# EAGLE design schema_rs232_MAX3232 (EAGLE 9.0.1)
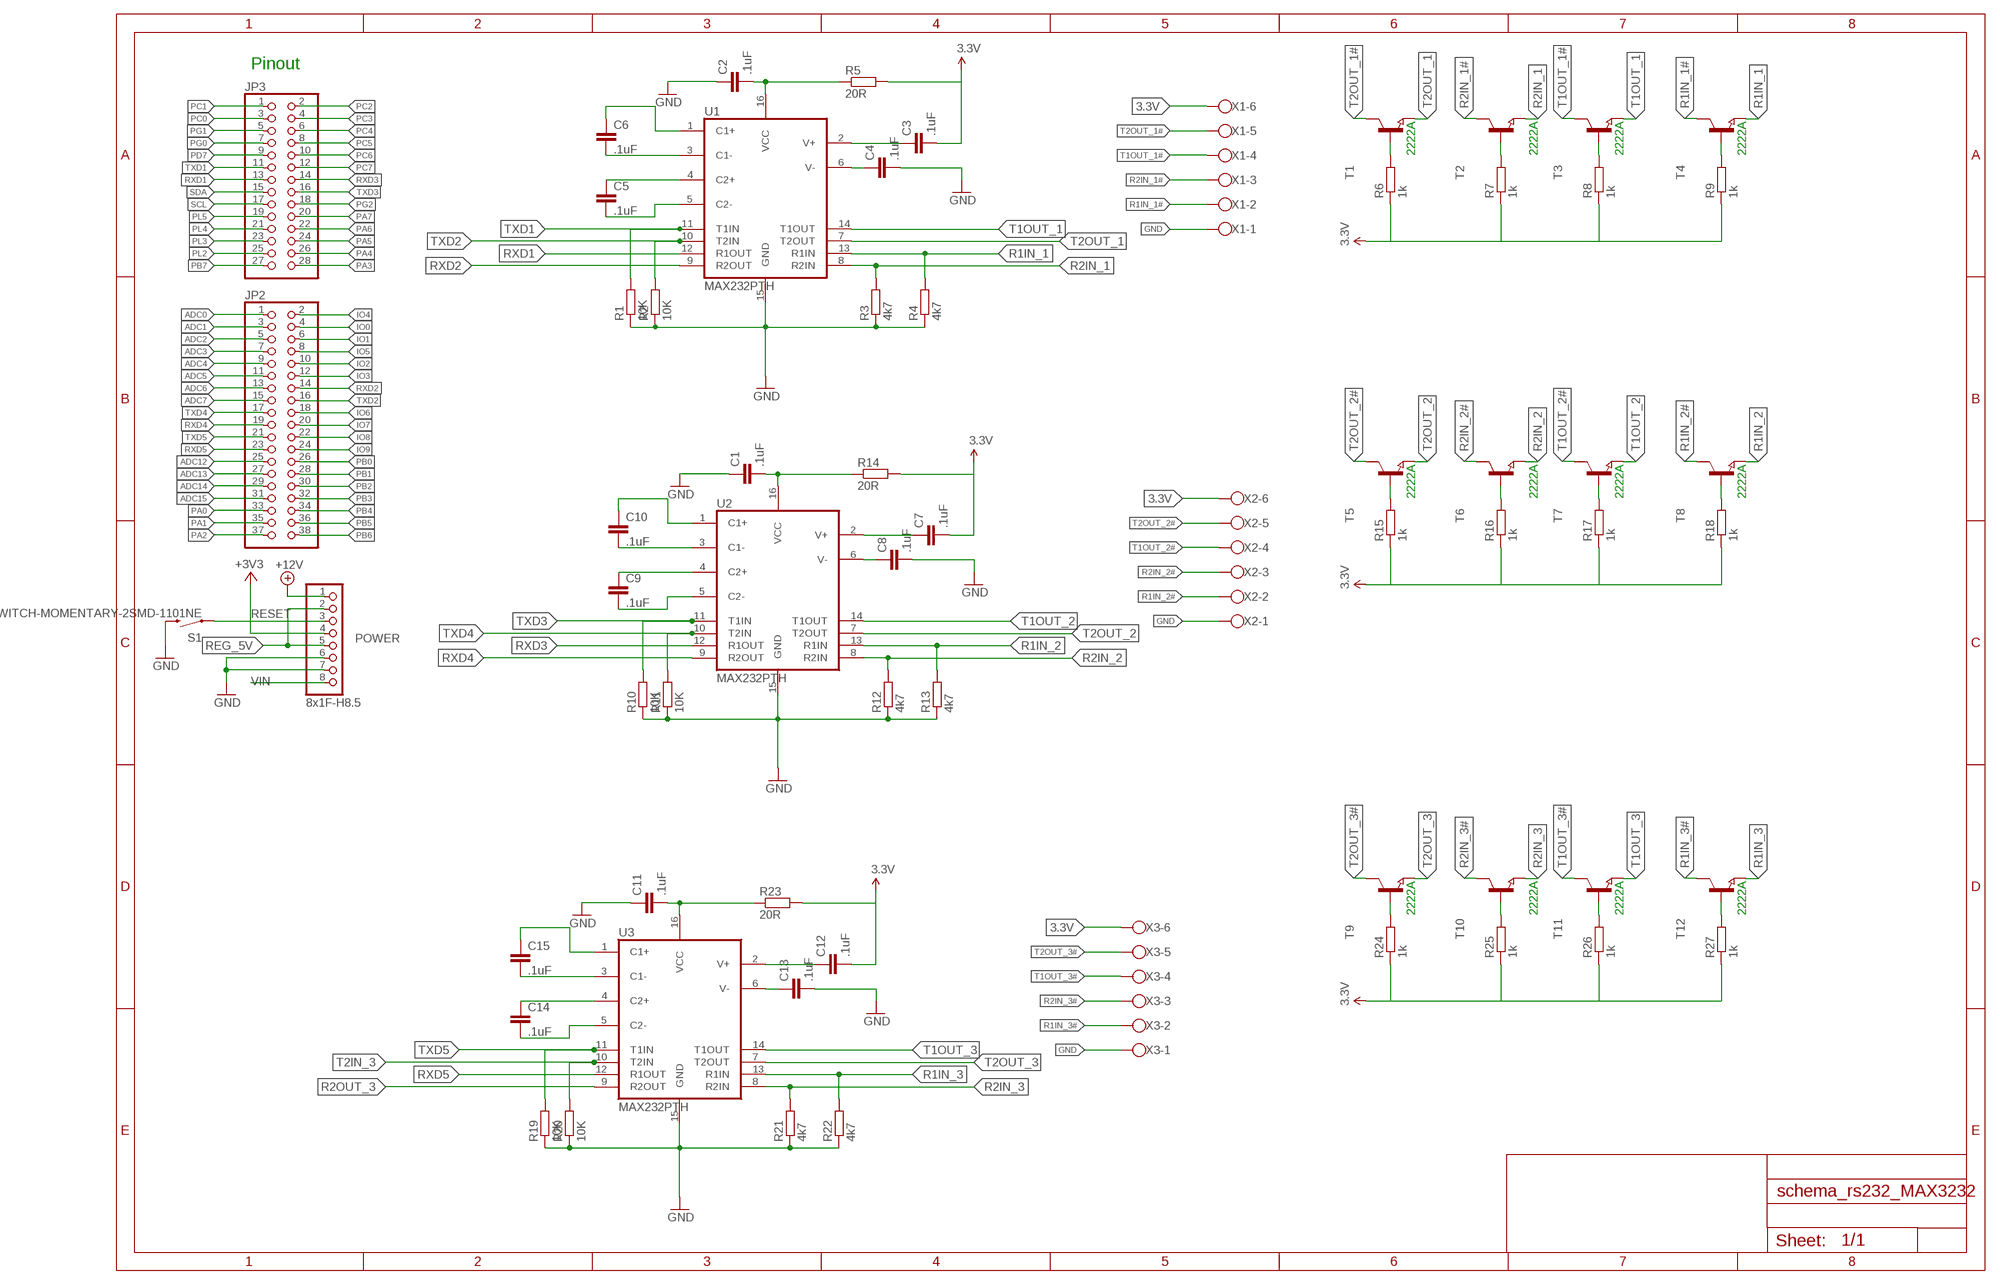
[diagram p0: schematic, sheet 1]

## Parts
C1  .1uF  C-EUC0805  [C0805]
C2  .1uF  C-EUC0805  [C0805]
C3  .1uF  C-EUC0805  [C0805]
C4  .1uF  C-EUC0805  [C0805]
C5  .1uF  C-EUC0805  [C0805]
C6  .1uF  C-EUC0805  [C0805]
C7  .1uF  C-EUC0805  [C0805]
C8  .1uF  C-EUC0805  [C0805]
C9  .1uF  C-EUC0805  [C0805]
C10  .1uF  C-EUC0805  [C0805]
C11  .1uF  C-EUC0805  [C0805]
C12  .1uF  C-EUC0805  [C0805]
C13  .1uF  C-EUC0805  [C0805]
C14  .1uF  C-EUC0805  [C0805]
C15  .1uF  C-EUC0805  [C0805]
JP2  PINHD-2X19  [2X19]
JP3  PINHD-2X14  [2X14]
POWER  8x1F-H8.5  PINHD-1X8  [1X08]
R1  10K  R-EU_R0805  [R0805]
R2  10K  R-EU_R0805  [R0805]
R3  4k7  R-EU_R0805  [R0805]
R4  4k7  R-EU_R0805  [R0805]
R5  20R  R-EU_R0805  [R0805]
R6  1k  R-EU_R0805  [R0805]
R7  1k  R-EU_R0805  [R0805]
R8  1k  R-EU_R0805  [R0805]
R9  1k  R-EU_R0805  [R0805]
R10  10K  R-EU_R0805  [R0805]
R11  10K  R-EU_R0805  [R0805]
R12  4k7  R-EU_R0805  [R0805]
R13  4k7  R-EU_R0805  [R0805]
R14  20R  R-EU_R0805  [R0805]
R15  1k  R-EU_R0805  [R0805]
R16  1k  R-EU_R0805  [R0805]
R17  1k  R-EU_R0805  [R0805]
R18  1k  R-EU_R0805  [R0805]
R19  10K  R-EU_R0805  [R0805]
R20  10K  R-EU_R0805  [R0805]
R21  4k7  R-EU_R0805  [R0805]
R22  4k7  R-EU_R0805  [R0805]
R23  20R  R-EU_R0805  [R0805]
R24  1k  R-EU_R0805  [R0805]
R25  1k  R-EU_R0805  [R0805]
R26  1k  R-EU_R0805  [R0805]
R27  1k  R-EU_R0805  [R0805]
S1  SWITCH-MOMENTARY-2SMD-1101NE  [TACTILE-SWITCH-1101NE]
T1  NPN-TRANSISTOR_SOT23  [SOT23]
T2  NPN-TRANSISTOR_SOT23  [SOT23]
T3  NPN-TRANSISTOR_SOT23  [SOT23]
T4  NPN-TRANSISTOR_SOT23  [SOT23]
T5  NPN-TRANSISTOR_SOT23  [SOT23]
T6  NPN-TRANSISTOR_SOT23  [SOT23]
T7  NPN-TRANSISTOR_SOT23  [SOT23]
T8  NPN-TRANSISTOR_SOT23  [SOT23]
T9  NPN-TRANSISTOR_SOT23  [SOT23]
T10  NPN-TRANSISTOR_SOT23  [SOT23]
T11  NPN-TRANSISTOR_SOT23  [SOT23]
T12  NPN-TRANSISTOR_SOT23  [SOT23]
U1  MAX232PTH  [DIL16]
U2  MAX232PTH  [DIL16]
U3  MAX232PTH  [DIL16]
X1  W237-6  [W237-6]
X2  W237-6  [W237-6]
X3  W237-6  [W237-6]

## Nets
3.3V: C3.2 C7.2 C12.2 POWER.4 R5.2 R6.1 R7.1 R8.1 R9.1 R14.2 R15.1 R16.1 R17.1 R18.1 R23.2 R24.1 R25.1 R26.1 R27.1 X1.6 X2.6 X3.6 ; supply symbol labelled +3V3
+12V: POWER.1
ADC0: JP2.1
ADC1: JP2.3
ADC2: JP2.5
ADC3: JP2.7
ADC4: JP2.9
ADC5: JP2.11
ADC6: JP2.13
ADC7: JP2.15
ADC12: JP2.25
ADC13: JP2.27
ADC14: JP2.29
ADC15: JP2.31
GND [gnd]: C1.1 C2.1 C4.2 C8.2 C11.1 C13.2 POWER.6 POWER.7 R1.1 R2.1 R3.1 R4.1 R10.1 R11.1 R12.1 R13.1 R19.1 R20.1 R21.1 R22.1 S1.2 U1.15(GND) U2.15(GND) U3.15(GND) X1.1 X2.1 X3.1
IO0: JP2.4
IO1: JP2.6
IO2: JP2.10
IO3: JP2.12
IO4: JP2.2
IO5: JP2.8
IO6: JP2.18
IO7: JP2.20
IO8: JP2.22
IO9: JP2.24
N$1: C10.2 U2.3(C1-)
N$2: C10.1 U2.1(C1+)
N$3: C9.2 U2.5(C2-)
N$4: C9.1 U2.4(C2+)
N$5: C8.1 U2.6(V-)
N$6: C1.2 R14.1 U2.16(VCC)
N$7: C7.1 U2.2(V+)
N$8: R15.2 T5.1(B)
N$9: R16.2 T6.1(B)
N$10: R17.2 T7.1(B)
N$11: R18.2 T8.1(B)
N$12: C15.2 U3.3(C1-)
N$13: C15.1 U3.1(C1+)
N$14: C14.2 U3.5(C2-)
N$15: C6.2 U1.3(C1-)
N$16: C6.1 U1.1(C1+)
N$17: C5.2 U1.5(C2-)
N$18: C5.1 U1.4(C2+)
N$19: C4.1 U1.6(V-)
N$20: C2.2 R5.1 U1.16(VCC)
N$21: C3.1 U1.2(V+)
N$22: R6.2 T1.1(B)
N$23: R7.2 T2.1(B)
N$24: R8.2 T3.1(B)
N$25: R9.2 T4.1(B)
N$26: C14.1 U3.4(C2+)
N$27: C13.1 U3.6(V-)
N$28: C11.2 R23.1 U3.16(VCC)
N$29: C12.1 U3.2(V+)
N$30: R24.2 T9.1(B)
N$31: R25.2 T10.1(B)
N$32: R26.2 T11.1(B)
N$33: R27.2 T12.1(B)
PA0: JP2.33
PA1: JP2.35
PA2: JP2.37
PA3: JP3.28
PA4: JP3.26
PA5: JP3.24
PA6: JP3.22
PA7: JP3.20
PB0: JP2.26
PB1: JP2.28
PB2: JP2.30
PB3: JP2.32
PB4: JP2.34
PB5: JP2.36
PB6: JP2.38
PB7: JP3.27
PC0: JP3.3
PC1: JP3.1
PC2: JP3.2
PC3: JP3.4
PC4: JP3.6
PC5: JP3.8
PC6: JP3.10
PC7: JP3.12
PD7: JP3.9
PG0: JP3.7
PG1: JP3.5
PG2: JP3.18
PL2: JP3.25
PL3: JP3.23
PL4: JP3.21
PL5: JP3.19
R1IN_1: R4.2 T4.2(E) U1.13(R1IN)
R1IN_1#: T4.3(C) X1.2
R1IN_2: R13.2 T8.2(E) U2.13(R1IN)
R1IN_2#: T8.3(C) X2.2
R1IN_3: R22.2 T12.2(E) U3.13(R1IN)
R1IN_3#: T12.3(C) X3.2
R2IN_1: R3.2 T2.2(E) U1.8(R2IN)
R2IN_1#: T2.3(C) X1.3
R2IN_2: R12.2 T6.2(E) U2.8(R2IN)
R2IN_2#: T6.3(C) X2.3
R2IN_3: R21.2 T10.2(E) U3.8(R2IN)
R2IN_3#: T10.3(C) X3.3
R2OUT_3: U3.9(R2OUT)
REG_5V: POWER.2 POWER.5
RESET: POWER.3 S1.1
RXD1: JP3.13 U1.12(R1OUT)
RXD2: JP2.14 U1.9(R2OUT)
RXD3: JP3.14 U2.12(R1OUT)
RXD4: JP2.19 U2.9(R2OUT)
RXD5: JP2.23 U3.12(R1OUT)
SCL: JP3.17
SDA: JP3.15
T1OUT_1: T3.2(E) U1.14(T1OUT)
T1OUT_1#: T3.3(C) X1.4
T1OUT_2: T7.2(E) U2.14(T1OUT)
T1OUT_2#: T7.3(C) X2.4
T1OUT_3: T11.2(E) U3.14(T1OUT)
T1OUT_3#: T11.3(C) X3.4
T2IN_3: R20.2 U3.10(T2IN)
T2OUT_1: T1.2(E) U1.7(T2OUT)
T2OUT_1#: T1.3(C) X1.5
T2OUT_2: T5.2(E) U2.7(T2OUT)
T2OUT_2#: T5.3(C) X2.5
T2OUT_3: T9.2(E) U3.7(T2OUT)
T2OUT_3#: T9.3(C) X3.5
TXD1: JP3.11 R1.2 U1.11(T1IN)
TXD2: JP2.16 R2.2 U1.10(T2IN)
TXD3: JP3.16 R10.2 U2.11(T1IN)
TXD4: JP2.17 R11.2 U2.10(T2IN)
TXD5: JP2.21 R19.2 U3.11(T1IN)
VIN [power]: POWER.8

## Notes on the sheet
- Pinout
- 2222A | 2222A | 2222A | 2222A
- 2222A | 2222A | 2222A | 2222A
- 2222A | 2222A | 2222A | 2222A

## Library data of the parts
C1-C15 = rcl:C-EU: CAPACITOR, European symbol; SPICEPREFIX: C
JP2 = pinhead:PINHD-2X19: PIN HEADER
JP3 = pinhead:PINHD-2X14: PIN HEADER
POWER = SmartPrj:PINHD-1X8: PIN HEADER
R1-R27 = rcl:R-EU_: RESISTOR, European symbol; SPICEPREFIX: R
S1 = SparkFun-Electromechanical:SWITCH-MOMENTARY-2: Various NO switches- pushbuttons, reed, etc; PROD_ID: SWCH-00815
T1-T12 = semicon-smd-ipc:NPN-TRANSISTOR_: NPN TRANSISTOR
U1-U3 = SparkFun-DigitalIC:MAX232: RS232 Transceiver Very common IC. This is generically called 'MAX232', but works with the 3V equivalent MAX3232 generic ICs. Field tested and mother approved. Spark Fun Electronics SKU : COM-00316 (DIP) and COM-00589 (SMD)
X1-X3 = con-wago-500:W237-6: WAGO SCREW CLAMP; OC_FARNELL: unknown; OC_NEWARK: unknown

## Net classes
1 power: width 0.152 mm, drill 0.152 mm, clearance 0.152 mm
2 gnd: width 0.152 mm, drill 0.152 mm, clearance 0.152 mm
3 power usb: width 0.152 mm, drill 0.152 mm, clearance 0.152 mm

## Board
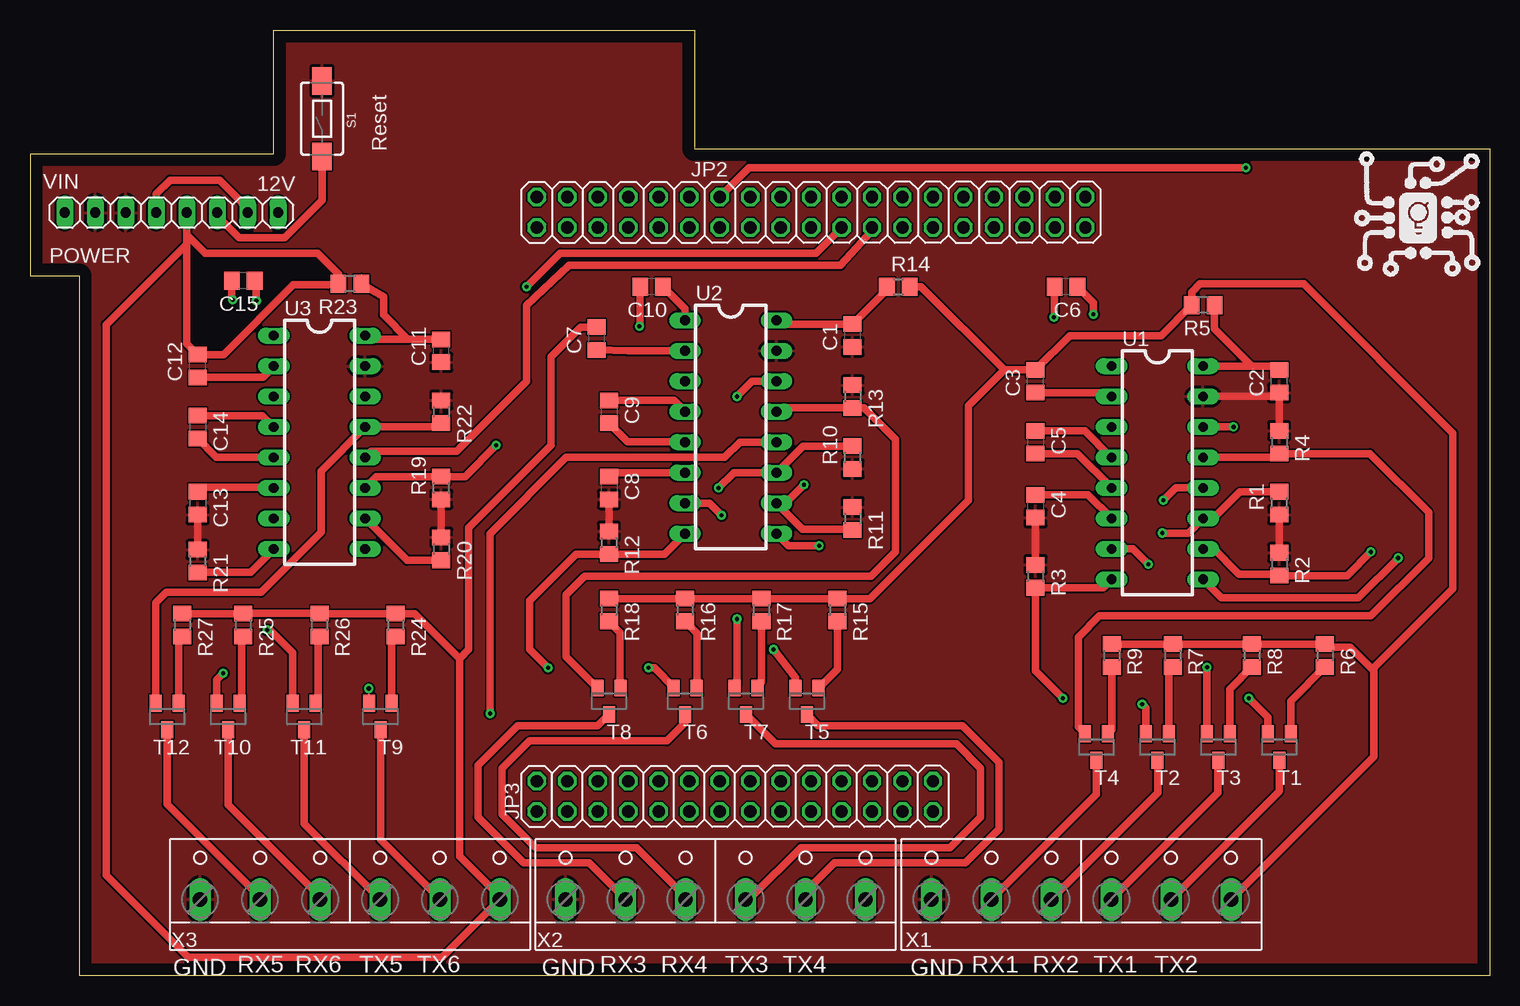
[diagram p1: board, top side]
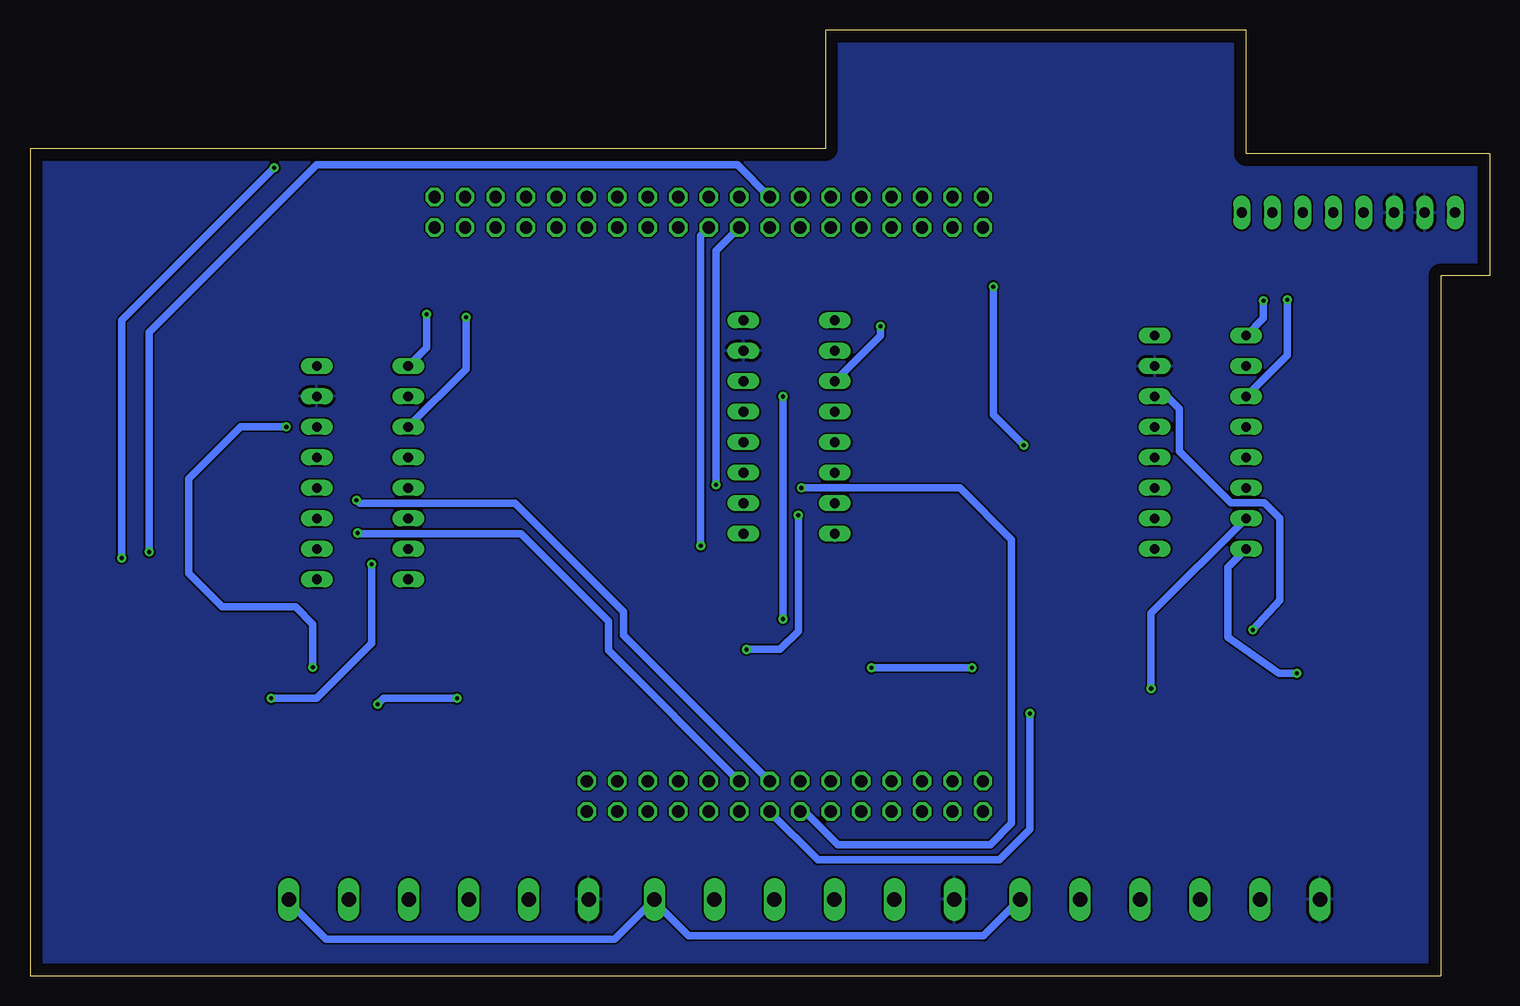
[diagram p2: board, bottom side, seen from below]

Size 121.7 x 78.8 mm. Coordinates in mm from the lower left corner, seen from the top.
Outline: 0,68.5 20.3,68.5 20.3,78.8 55.4,78.8 55.4,68.9 121.7,68.9 121.7,0 4.09,0 4.09,58.32 0,58.32 0,68.48
Copper layers (1*16): Top 0.035mm / dielectric 1.5mm / Bottom 0.035mm
Design rules "default": minimum track width 6mil, minimum drill 0.35mm, track to track 6mil, track to pad 6mil, pad to pad 6mil, via to via 6mil, smd to smd 6mil, copper to edge 40mil, drill to drill 6mil, minimum pad ring 10mil, minimum via ring 8mil, stop-mask expansion 4mil, vias tented up to drill 0mil, thermal gap 10mil

### Footprints (pad centres in the part's own frame; a part is rotated, then mirrored left to right if it is on the bottom)
C0805 = smd 1.3 x 1.5: 1 -0.95,0; 2 0.95,0
2X19 = drill 1.016 octagon: 1 -22.86,-1.27; 2 -22.86,1.27; 3 -20.32,-1.27; 4 -20.32,1.27; 5 -17.78,-1.27; 6 -17.78,1.27; 7 -15.24,-1.27; 8 -15.24,1.27; 9 -12.7,-1.27; 10 -12.7,1.27; 11 -10.16,-1.27; 12 -10.16,1.27; 13 -7.62,-1.27; 14 -7.62,1.27; 15 -5.08,-1.27; 16 -5.08,1.27; 17 -2.54,-1.27; 18 -2.54,1.27; 19 0,-1.27; 20 0,1.27; 21 2.54,-1.27; 22 2.54,1.27; 23 5.08,-1.27; 24 5.08,1.27; 25 7.62,-1.27; 26 7.62,1.27; 27 10.16,-1.27; 28 10.16,1.27; 29 12.7,-1.27; 30 12.7,1.27; 31 15.24,-1.27; 32 15.24,1.27; 33 17.78,-1.27; 34 17.78,1.27; 35 20.32,-1.27; 36 20.32,1.27; 37 22.86,-1.27; 38 22.86,1.27
2X14 = drill 1.016 octagon: 1 -16.51,-1.27; 2 -16.51,1.27; 3 -13.97,-1.27; 4 -13.97,1.27; 5 -11.43,-1.27; 6 -11.43,1.27; 7 -8.89,-1.27; 8 -8.89,1.27; 9 -6.35,-1.27; 10 -6.35,1.27; 11 -3.81,-1.27; 12 -3.81,1.27; 13 -1.27,-1.27; 14 -1.27,1.27; 15 1.27,-1.27; 16 1.27,1.27; 17 3.81,-1.27; 18 3.81,1.27; 19 6.35,-1.27; 20 6.35,1.27; 21 8.89,-1.27; 22 8.89,1.27; 23 11.43,-1.27; 24 11.43,1.27; 25 13.97,-1.27; 26 13.97,1.27; 27 16.51,-1.27; 28 16.51,1.27
1X08 = drill 0.85 pad 1.422 long: 1 -8.89,0; 2 -6.35,0; 3 -3.81,0; 4 -1.27,0; 5 1.27,0; 6 3.81,0; 7 6.35,0; 8 8.89,0
R0805 = smd 1.3 x 1.5: 1 -0.95,0; 2 0.95,0
TACTILE-SWITCH-1101NE = smd 2.3 x 1.6: 1 -3.15,0; 2 3.15,0
SOT23 = smd 1 x 1.4: 1 -0.95,-1.1; 2 0.95,-1.1; 3 0,1.1
DIL16 = drill 0.813 long: 1 -8.89,-3.81; 2 -6.35,-3.81; 3 -3.81,-3.81; 4 -1.27,-3.81; 5 1.27,-3.81; 6 3.81,-3.81; 7 6.35,-3.81; 8 8.89,-3.81; 9 8.89,3.81; 10 6.35,3.81; 11 3.81,3.81; 12 1.27,3.81; 13 -1.27,3.81; 14 -3.81,3.81; 15 -6.35,3.81; 16 -8.89,3.81
W237-6 = drill 1.194 long: 1 -12.5,-1.27; 2 -7.5,-1.27; 3 -2.5,-1.27; 4 2.5,-1.27; 5 7.5,-1.27; 6 12.5,-1.27

### Placement (x,y rotation side)
C1  68.58,53.34 90 top
C2  104.14,49.53 90 top
C3  83.82,49.53 90 top
C4  83.82,39.12 270 top
C5  83.82,44.45 270 top
C6  86.36,57.4 180 top
C7  47.24,53.09 90 top
C8  48.26,40.64 270 top
C9  48.26,46.99 270 top
C10  51.82,57.4 180 top
C11  34.29,52.07 90 top
C12  13.97,50.8 90 top
C13  13.97,39.37 270 top
C14  13.97,45.72 270 top
C15  17.78,57.91 180 top
JP2  65.12,63.61 0 top
JP3  58.77,14.94 180 top
POWER  11.8,63.59 180 top
R1  104.14,39.37 90 top
R2  104.14,34.29 270 top
R3  83.82,33.27 270 top
R4  104.14,44.45 270 top
R5  97.79,55.88 180 top
R6  107.95,26.67 270 top
R7  95.25,26.67 270 top
R8  101.85,26.67 270 top
R9  90.17,26.67 270 top
R10  68.58,43.18 90 top
R11  68.58,38.1 270 top
R12  48.26,36.07 270 top
R13  68.58,48.26 270 top
R14  72.39,57.4 0 top
R15  67.31,30.48 270 top
R16  54.61,30.48 270 top
R17  60.96,30.48 270 top
R18  48.26,30.48 270 top
R19  34.29,40.64 90 top
R20  34.29,35.56 270 top
R21  13.97,34.54 270 top
R22  34.29,46.99 270 top
R23  26.67,57.66 180 top
R24  30.48,29.21 270 top
R25  17.78,29.21 270 top
R26  24.13,29.21 270 top
R27  12.7,29.21 270 top
S1  24.34,71.41 90 top
T1  104.14,19.05 180 top
T2  93.98,19.05 180 top
T3  99.06,19.05 180 top
T4  88.9,19.05 180 top
T5  64.77,22.86 180 top
T6  54.61,22.86 180 top
T7  59.69,22.86 180 top
T8  48.26,22.86 180 top
T9  29.21,21.59 180 top
T10  16.51,21.59 180 top
T11  22.86,21.59 180 top
T12  11.43,21.59 180 top
U1  93.98,41.91 270 top
U2  58.42,45.72 270 top
U3  24.13,44.45 270 top
X1  87.63,7.62 0 top
X2  57.15,7.62 0 top
X3  26.67,7.62 0 top

### Tracks (layer width: path | path; a pad name or v marks a point on that pad's centre or on a via)
3.3V
  Top 0.152: R26.1 24.13,30.18 30.45,30.18 R24.1 30.53,30.1 30.84,29.79 | 39.14,7.47 39.14,6.6 39.14,6.4 X3.6 | 67.79,31.39 67.56,31.39 67.34,31.39 R15.1 67.26,31.39 61.01,31.39 R17.1 60.93,31.39 54.61,31.39 R16.1 | 69.62,6.4 X2.6 | 21.95,57.56 18.34,53.95 | 13.08,62.64 13.08,63.55 POWER.4 | 96.44,55.47 96.81,55.84 96.83,55.85 R5.2 | R9.1 90.19,27.58 95.22,27.58 R7.1 95.3,27.58 98.58,27.58 | 108.71,27.36 108.18,27.36 107.95,27.58 R6.1 | 25.73,58.45 R23.2
  Top 0.61: POWER.4 13.07,61.72 | 13.07,61.72 13.07,60.96 | 13.07,60.96 13.07,52.66 C12.2 16.14,51.75 21.95,57.56 24.86,57.56 R23.2 | R27.1 R25.1 17.8,30.18 24.13,30.18 | R26.1 R24.1 30.53,30.1 | R24.1 32.07,30.16 35.81,26.42 | 39.14,6.6 35.81,9.93 35.81,26.42 | X1.6 112.01,18.23 112.01,25.4 111.89,25.53 | 111.89,25.53 110.06,27.36 108.71,27.36 | R6.1 R8.1 R7.1 | R9.1 95.19,27.62 95.22,27.58 | 96.81,55.84 94.31,53.34 86.68,53.34 C3.2 81.21,50.48 | R18.1 48.3,31.39 54.61,31.39 | R16.1 54.65,31.39 60.93,31.39 | R17.1 61,31.39 67.56,31.39 | 67.79,31.39 70,31.39 78.23,39.62 78.23,47.5 81.21,50.48 | R14.2 74.29,57.4 81.21,50.48 | C7.2 45.91,54.04 43.43,51.56 43.43,44.2 36.58,37.34 36.58,27.18 35.81,26.42 | 13.07,61.72 14.59,60.2 23.98,60.2 25.73,58.45 | 13.07,60.96 6.35,54.24 6.35,8.38 13.21,1.52 34.34,1.52 X3.6 | R5.2 96.84,56.96 97.54,57.66 106.17,57.66 118.62,45.21 118.62,32.26 111.89,25.53
  Bottom 0.61: X3.6 42.22,3.3 66.8,3.3 69.65,6.15 X2.6 72.95,3.05 97.03,3.05 100.13,6.15 X1.6
GND
  Top 0.61: R21.1 C13.2 | R20.1 R19.1 | R3.1 C4.2 | U1.15 103.82,48.26 C2.1 R4.1 | R1.1 R2.1 | R12.1 C8.2
  pour Top: -0.69,78.93 121.91,78.93 121.91,-0.16 -0.69,-0.16
  pour Bottom: -0.16,78.84 -0.25,-0.19 121.79,-0.19 121.88,78.84
N$1  (via drill 0.35)
  Top 0.61: C10.2 50.87,54.17 v50.8,54.1
  Bottom 0.61: v50.8,54.1 50.8,53.34 U2.3
N$2
  Top 0.61: C10.1 54.61,55.56 U2.1
N$3
  Top 0.152: 54.61,44.5 U2.5
  Top 0.61: C9.2 49.8,44.5 54.61,44.5
N$4
  Top 0.152: 54.61,47.02 U2.4
  Top 0.61: C9.1 53.68,47.94 54.61,47.02
N$5
  Top 0.61: C8.1 48.58,41.91 U2.6
N$6
  Top 0.152: 68.61,54.25 C1.2 68.53,54.33 68.45,54.41
  Top 0.61: R14.1 71.44,57.15 C1.2 62.55,54.29 U2.16
N$7
  Top 0.61: C7.1 49.85,52.07 U2.2
N$8
  Top 0.61: R15.2 67.31,25.55 T5.1
N$9
  Top 0.152: 55.6,24 T6.1
  Top 0.61: R16.2 55.6,28.54 55.6,24
N$10
  Top 0.152: 60.63,24.13 60.63,24 T7.1
  Top 0.61: R17.2 60.96,24.46 60.63,24.13
N$11
  Top 0.152: 49.2,24.13 49.2,24 T8.1
  Top 0.61: R18.2 49.2,28.59 49.2,24.13
N$12  (via drill 0.35)
  Top 0.61: C15.2 16.83,56.37 v16.89,56.31
  Bottom 0.61: v16.89,56.31 16.89,51.69 U3.3
N$13  (via drill 0.35)
  Top 0.152: 18.72,58.37 C15.1
  Top 0.61: v18.87,56.24 18.87,58.22 18.72,58.37
  Bottom 0.152: 18.9,56.19 v18.87,56.24
  Bottom 0.61: U3.1 18.9,54.76 18.9,56.19
N$14
  Top 0.152: 20.32,43.2 U3.5
  Top 0.61: C14.2 15.54,43.2 20.32,43.2
N$15  (via drill 0.35)
  Top 0.61: C6.2 85.41,54.93 v85.34,54.86
  Bottom 0.61: v85.34,54.86 85.34,50.55 U1.3
N$16  (via drill 0.35)
  Top 0.152: 90.19,50.82 U1.1
  Top 0.61: C6.1 88.65,56.07 v88.65,55.12
  Bottom 0.61: v88.65,55.12 88.65,52.32 U1.1
N$17
  Top 0.61: U1.5 87.31,43.5 C5.2
N$18
  Top 0.152: 90.12,43.2 U1.4
  Top 0.61: C5.1 87.92,45.4 90.12,43.2
N$19
  Top 0.61: C4.1 88.2,40.07 U1.6
N$20
  Top 0.152: 98.73,55.85 R5.1 | 104.14,50.44 C2.2
  Top 0.61: C2.2 103.82,50.8 101.85,50.8 | 101.85,50.8 U1.16 | R5.1 98.74,53.91 101.85,50.8
N$21
  Top 0.61: C3.1 89.85,48.58 U1.2
N$22
  Top 0.61: R6.2 105.09,22.86 T1.1
N$23
  Top 0.152: 95.22,25.68 R7.2
  Top 0.61: T2.1 94.93,25.39 95.22,25.68
N$24
  Top 0.152: 100.02,20.19 T3.1
  Top 0.61: R8.2 100.01,23.88 T3.1
N$25
  Top 0.152: 90.65,25.22 90.19,25.68 R9.2 | 89.89,20.12 T4.1
  Top 0.61: R9.2 90.17,20.47 T4.1
N$26
  Top 0.152: 20.19,45.85 U3.4
  Top 0.61: C14.1 19.37,46.67 20.19,45.85
N$27
  Top 0.152: 20.32,40.69 U3.6
  Top 0.61: C13.1 14.34,40.69 20.32,40.69
N$28
  Top 0.152: 27.63,58.37 R23.1
  Top 0.61: C11.2 31.5,53.02 | R23.1 29.46,56.58 29.46,55.05 31.5,53.02 | U3.16 28.26,53.02 31.5,53.02
N$29
  Top 0.152: 20.32,50.75 U3.2
  Top 0.61: C12.1 19.42,49.85 20.32,50.75
N$30
  Top 0.152: 30.34,28.08 30.45,28.19 R24.2
  Top 0.61: T9.1 30.16,27.9 30.34,28.08
N$31
  Top 0.152: 17.63,28.09 17.73,28.19 R25.2
  Top 0.61: T10.1 17.63,22.86 17.63,28.09
N$32
  Top 0.152: 24,28.07 24.13,28.19 R26.2
  Top 0.61: T11.1 24,22.88 24,28.07
N$33
  Top 0.152: 12.39,27.69 12.39,27.89 12.7,28.19 R27.2
  Top 0.61: T12.1 12.39,22.71 12.39,27.69
R1IN_1
  Top 0.152: 87.99,20.19 T4.2
  Top 0.61: U1.13 103.82,43.18 R4.2 111.69,43.5 116.59,38.61 116.59,34.8 111.76,29.97 89.15,29.97 87.38,28.19 87.38,20.72 T4.2
R1IN_1#
  Top 0.152: 88.9,17.53 T4.3
  Top 0.61: X1.2 88.9,15.12 88.9,17.53
R1IN_2
  Top 0.152: 47.3,24 T8.2
  Top 0.61: T8.2 44.7,26.57 44.7,31.75 46.23,33.27 70.1,33.27 72.14,35.31 72.14,44.7 69.53,47.31 R13.2 62.55,47.31 U2.13
R1IN_2#
  Top 0.61: T8.3 47.33,20.83 40.64,20.83 37.34,17.53 37.34,13.21 41.15,9.4 46.6,9.4 X2.2
R1IN_3
  Top 0.152: 10.49,22.86 10.49,22.71 T12.2 | 34.27,46.02 R22.2
  Top 0.61: 10.49,22.86 10.49,31.06 11.35,31.93 19.25,31.93 24.27,36.94 24.27,42.05 U3.13 33.96,45.72 34.27,46.02
R1IN_3#
  Top 0.152: 19.1,6.6 19.1,6.4 X3.2
  Top 0.61: T12.3 11.43,14.28 19.1,6.6
R2IN_1  (via drill 0.35)
  Top 0.152: 93.02,20.19 T2.2
  Top 0.61: U1.8 89.47,32.32 R3.2 83.82,25.4 v86.11,23.11 | v92.71,22.61 93.02,22.3 93.02,20.19
  Bottom 0.61: v86.11,23.11 92.2,23.11 v92.71,22.61
R2IN_1#
  Top 0.152: 94,17.53 94,17.91 T2.3
  Top 0.61: X1.3 94,15.22 94,17.53
R2IN_2  (via drill 0.35)
  Top 0.152: 53.7,24 T6.2 | 54.61,36.88 U2.8
  Top 0.61: U2.8 52.9,35.12 R12.2 45.53,35.12 41.66,31.24 41.66,27.18 v43.18,25.65 | v51.56,25.65 52.04,25.65 53.7,24
  Bottom 0.152: U2.8 54.61,36.2
  Bottom 0.61: v43.18,25.65 v51.56,25.65
R2IN_2#
  Top 0.152: 54.61,6.6 54.61,6.4 X2.3
  Top 0.61: T6.3 54.61,21.08 53.09,19.56 41.66,19.56 39.37,17.27 39.37,13.46 42.16,10.67 50.55,10.67 54.61,6.6
R2IN_3  (via drill 0.35)
  Top 0.152: 20.24,35.43 20.32,35.51 U3.8
  Top 0.61: R21.2 18.41,33.59 20.24,35.43 | v16.1,25.2 15.56,24.65 T10.2
  Bottom 0.61: U3.8 21.84,34.04 21.84,28.19 17.58,25.2 v16.1,25.2
R2IN_3#
  Top 0.152: 24.13,6.6 24.13,6.4 X3.3
  Top 0.61: T10.3 16.51,14.22 24.13,6.6
REG_5V
  Top 0.61: POWER.5 10.53,65.13 11.68,66.29 15.82,66.29 17.95,64.17 18.11,64.01 18.14,63.97 POWER.2
RESET
  Top 0.152: 15.67,63.25 15.67,63.55 POWER.3
  Top 0.61: S1.1 24.34,64.6 21.23,61.49 17.42,61.49 15.67,63.25
RXD1  (via drill 0.35)
  Top 0.61: U1.12 95.5,40.64 v94.49,39.62
  Bottom 0.61: v94.49,39.62 94.23,39.37 81.28,39.37 72.22,30.32 72.22,28.36 60.07,16.21 JP3.13
RXD2  (via drill 0.35)
  Top 0.61: U1.9 99.31,31.5 110.74,31.5 v114.05,34.8 | v101.35,67.31 59.93,67.31 JP2.14
  Bottom 0.61: v114.05,34.8 114.05,54.61 v101.35,67.31
RXD3  (via drill 0.35)
  Top 0.61: U2.12 59.18,44.45 57.91,43.18 44.7,43.18 38.35,36.83 v38.35,21.84
  Bottom 0.152: 60.02,13.72 JP3.14
  Bottom 0.61: v38.35,21.84 38.35,12.19 40.89,9.65 56.02,9.65 JP3.14
RXD4  (via drill 0.35)
  Top 0.61: v65.79,35.81 63.25,35.81 U2.9
  Bottom 0.61: JP2.19 65.79,61.67 v65.79,35.81
RXD5
  Top 0.61: U3.12 28.45,43.69 35.56,43.69 41.4,49.53 41.4,55.88 44.96,59.18 67.56,59.18 70.19,62.07 JP2.23
T1OUT_1  (via drill 0.35)
  Top 0.152: 98.12,25.65 v98.12,25.71
  Top 0.61: U1.14 v100.33,45.72 | T3.2 98.11,25.64 98.12,25.65
  Bottom 0.61: v98.12,25.71 98.12,29.29 99.57,30.73 105.66,30.73 108.46,33.53 108.46,41.4 104.14,45.72 v100.33,45.72
T1OUT_1#
  Top 0.152: 99.03,17.27 99.03,17.91 T3.3
  Top 0.61: X1.4 99.03,15.26 99.03,17.27
T1OUT_2  (via drill 0.35)
  Top 0.152: 58.73,24 T7.2
  Top 0.61: U2.14 60.2,49.53 v58.93,48.26 | v58.93,29.72 58.93,24.15 T7.2
  Bottom 0.61: v58.93,48.26 v58.93,29.72
T1OUT_2#
  Top 0.152: 59.64,6.6 59.64,6.4 X2.4
  Top 0.61: T7.3 62.15,19.3 77.22,19.3 79.25,17.27 79.25,13.21 76.71,10.67 64.26,10.67 60.2,6.6 59.64,6.6
T1OUT_3  (via drill 0.35)
  Top 0.61: T11.2 21.91,26.89 19.99,28.8 v19.76,28.8
  Bottom 0.61: v19.76,28.8 17.53,31.29 17.53,38.1 18.82,39.39 21.62,39.39 25.91,43.69 25.91,47.24 26.92,48.26 U3.14
T1OUT_3#
  Top 0.61: T11.3 22.86,12.66 X3.4
T2IN_3
  Top 0.61: R20.2 31.43,34.61 U3.10
T2OUT_1  (via drill 0.35)
  Top 0.152: 103.15,20.19 T1.2
  Top 0.61: U1.7 91.95,35.56 v93.22,34.29 | v101.6,23.11 103.19,21.52 T1.2
  Bottom 0.61: v93.22,34.29 93.22,27.69 97.79,23.11 v101.6,23.11
T2OUT_1#
  Top 0.152: 104.14,17.78 T1.3
  Top 0.61: X1.5 104.14,15.36 104.14,17.78
T2OUT_2  (via drill 0.35)
  Top 0.61: U2.7 56.64,39.37 v57.66,38.35 | v61.98,27.18 63.82,24.83 T5.2
  Bottom 0.61: v57.66,38.35 57.66,28.7 59.18,27.18 v61.98,27.18
T2OUT_2#
  Top 0.152: 64.59,6.6 64.59,6.4 X2.5
  Top 0.61: T5.3 65.7,20.83 77.72,20.83 80.77,17.78 80.77,12.19 77.98,9.4 67.06,9.4 64.59,6.93 64.59,6.6
T2OUT_3  (via drill 0.35)
  Top 0.152: v28.24,23.93 28.24,22.71 T9.2
  Bottom 0.152: 28.24,24.13 v28.24,23.93
  Bottom 0.61: U3.7 28.24,30.18 28.24,24.13
T2OUT_3#
  Top 0.61: T9.3 29.21,11.31 X3.5
TXD1  (via drill 0.35)
  Top 0.152: 100.86,40.31 101.09,40.31 | R1.2
  Top 0.61: 100.86,40.31 98.65,38.1 U1.11 96.57,36.88 v94.39,36.88 | 101.09,40.31 R1.2
  Bottom 0.152: 73.36,26.98 73.48,27.1 | 94.31,36.8 v94.39,36.88
  Bottom 0.61: JP3.11 73.34,26.98 73.36,26.98 | 73.48,27.1 73.48,29.54 80.75,36.8 94.31,36.8
TXD2  (via drill 0.35)
  Top 0.152: 100.65,33.59 100.77,33.46 | 104.14,33.38 R2.2 | 97.74,35.59 U1.10
  Top 0.61: U1.10 98.68,35.56 100.65,33.59 | 100.77,33.46 104.05,33.46 104.14,33.38 | R2.2 109.79,33.34 v111.76,35.31
  Bottom 0.61: v111.76,35.31 111.76,53.59 97.79,67.56 62.72,67.56 JP2.16
TXD3  (via drill 0.35)
  Top 0.61: R10.2 64.45,44.13 U2.11 58.67,41.91 v57.4,40.64
  Bottom 0.152: 57.51,13.72 JP3.16
  Bottom 0.61: v57.4,40.64 44.2,40.64 39.88,36.32 39.88,12.7 41.66,10.92 54.36,10.92 57.15,13.72 57.51,13.72
TXD4  (via drill 0.35)
  Top 0.152: 68.33,37.19 68.53,37.19 R11.2
  Top 0.61: v64.52,40.89 62.99,39.37 U2.10 64.41,37.19 68.33,37.19
  Bottom 0.61: v64.52,40.89 64.52,60.4 JP2.17
TXD5  (via drill 0.35)
  Top 0.152: 27.94,40.69 U3.11
  Top 0.61: 27.94,40.69 28.84,41.59 R19.2 36.26,41.59 v38.86,44.2 | v41.4,57.4 44.2,60.2 65.52,60.2 JP2.21
  Bottom 0.152: 27.94,40.69 U3.11
  Bottom 0.61: v38.86,44.2 41.4,46.74 v41.4,57.4

### Text on the board
tPlace: VIN | 12V
tNames: Reset | GND | RX5 | RX6 | TX5 | TX6 | GND | RX3 | RX4 | TX3 | TX4 | GND | RX1 | RX2 | TX1 | TX2